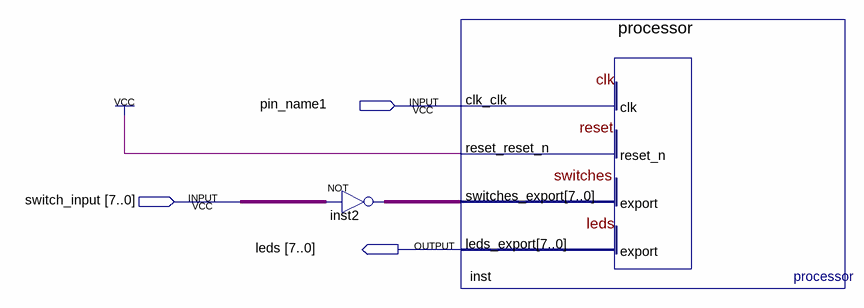
[diagram p0: schematic sheet]
// Quartus schematic projetoNios.bdf as structural Verilog: 2 symbols, 3 pins
module projetoNios (
  input  pin_name1,
  input  [7:0] switch_input,
  output [7:0] leds
);

  wire [7:0] inst2_out;

  assign inst2_out = ~switch_input;  // NOT inst2, 8 bits wide
  processor inst (.clk_clk(pin_name1), .reset_reset_n(1'b1), .switches_export(inst2_out), .leds_export(leds));
endmodule
